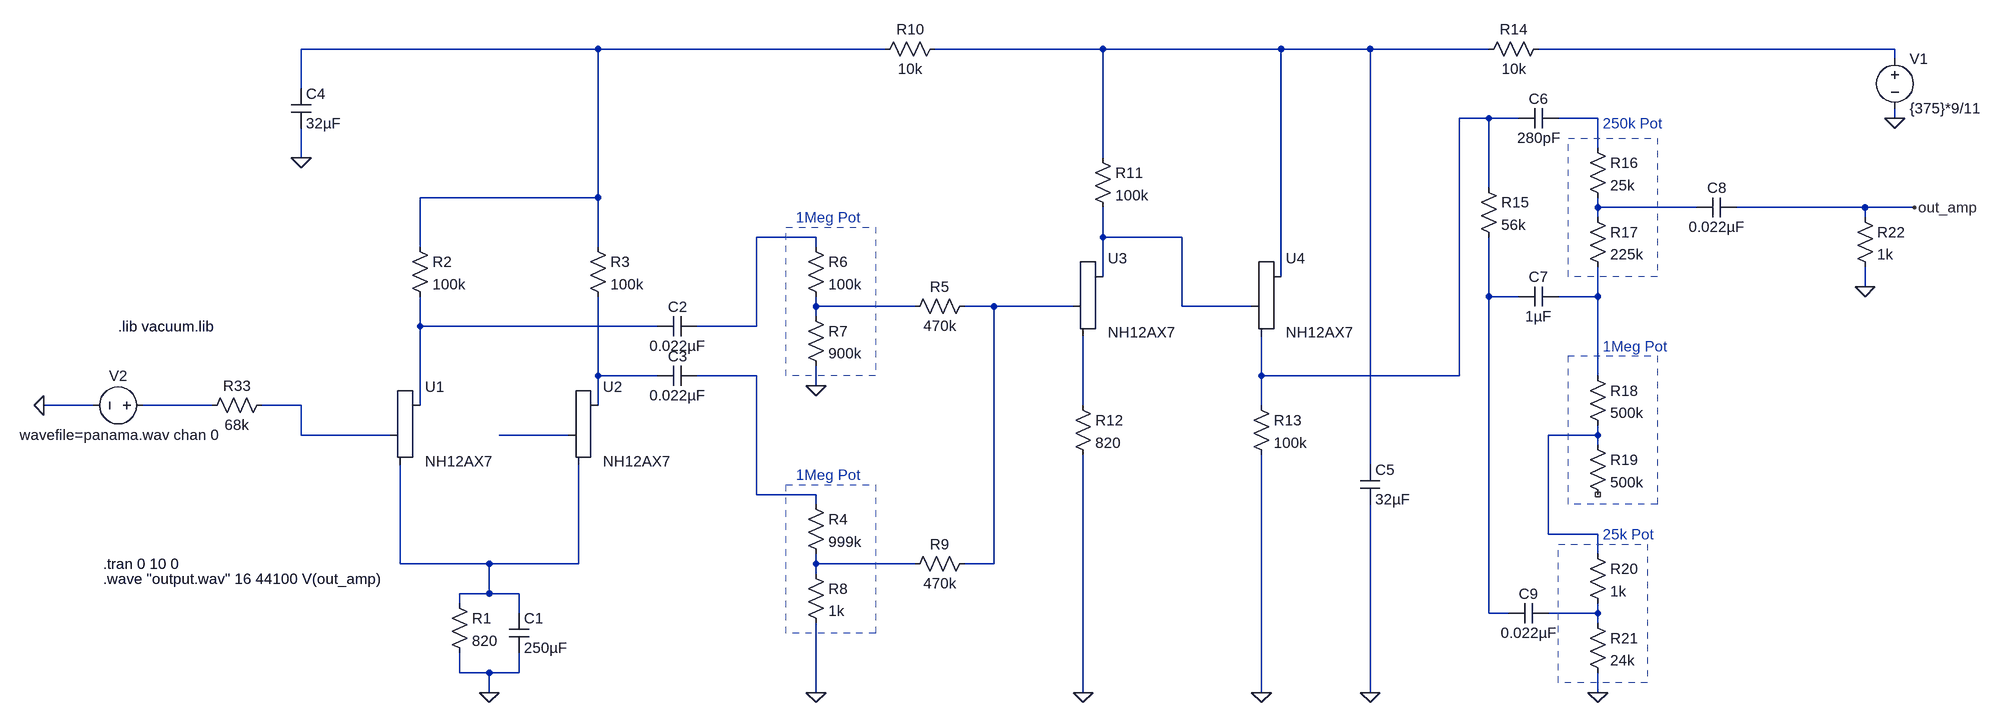
[diagram p0: schematic 1967 simle.asc]
1967 simle.asc, the LTspice schematic file:
Version 4
SHEET 1 3416 824
WIRE 656 -416 176 -416
WIRE 1120 -416 656 -416
WIRE 1472 -416 1200 -416
WIRE 1760 -416 1472 -416
WIRE 1904 -416 1760 -416
WIRE 2096 -416 1904 -416
WIRE 2752 -416 2176 -416
WIRE 2752 -400 2752 -416
WIRE 176 -352 176 -416
WIRE 2096 -304 2048 -304
WIRE 2144 -304 2096 -304
WIRE 2272 -304 2208 -304
WIRE 2752 -304 2752 -320
WIRE 2272 -256 2272 -304
WIRE 176 -240 176 -288
WIRE 1472 -240 1472 -416
WIRE 2096 -192 2096 -304
WIRE 656 -176 656 -416
WIRE 656 -176 368 -176
WIRE 2272 -160 2272 -176
WIRE 2432 -160 2272 -160
WIRE 2704 -160 2496 -160
WIRE 2784 -160 2704 -160
WIRE 2272 -144 2272 -160
WIRE 2704 -144 2704 -160
WIRE 1008 -112 912 -112
WIRE 1472 -112 1472 -160
WIRE 1600 -112 1472 -112
WIRE 368 -96 368 -176
WIRE 656 -96 656 -176
WIRE 1008 -96 1008 -112
WIRE 1472 -48 1472 -112
WIRE 1760 -48 1760 -416
WIRE 2704 -32 2704 -64
WIRE 2096 -16 2096 -112
WIRE 2144 -16 2096 -16
WIRE 2272 -16 2272 -64
WIRE 2272 -16 2208 -16
WIRE 1008 0 1008 -16
WIRE 1168 0 1008 0
WIRE 1296 0 1248 0
WIRE 1424 0 1296 0
WIRE 1600 0 1600 -112
WIRE 1712 0 1600 0
WIRE 1008 16 1008 0
WIRE 368 32 368 -16
WIRE 752 32 368 32
WIRE 912 32 912 -112
WIRE 912 32 816 32
WIRE 656 112 656 -16
WIRE 752 112 656 112
WIRE 912 112 816 112
WIRE 1728 112 1728 48
WIRE 2048 112 2048 -304
WIRE 2048 112 1728 112
WIRE 2272 112 2272 -16
WIRE 1008 128 1008 96
WIRE -160 160 -240 160
WIRE 32 160 -80 160
WIRE 176 160 112 160
WIRE 368 160 368 32
WIRE 656 160 656 112
WIRE 1440 160 1440 48
WIRE 1728 160 1728 112
WIRE 176 208 176 160
WIRE 320 208 176 208
WIRE 608 208 496 208
WIRE 2272 208 2272 192
WIRE 2272 208 2192 208
WIRE 2272 224 2272 208
WIRE 1904 256 1904 -416
WIRE 912 304 912 112
WIRE 1008 304 912 304
WIRE 1008 320 1008 304
WIRE 2192 368 2192 208
WIRE 2272 368 2192 368
WIRE 2272 400 2272 368
WIRE 336 416 336 256
WIRE 480 416 336 416
WIRE 624 416 624 256
WIRE 624 416 480 416
WIRE 1008 416 1008 400
WIRE 1168 416 1008 416
WIRE 1296 416 1296 0
WIRE 1296 416 1248 416
WIRE 1008 432 1008 416
WIRE 480 464 480 416
WIRE 480 464 432 464
WIRE 528 464 480 464
WIRE 432 480 432 464
WIRE 528 496 528 464
WIRE 2096 496 2096 -16
WIRE 2128 496 2096 496
WIRE 2272 496 2272 480
WIRE 2272 496 2192 496
WIRE 2272 512 2272 496
WIRE 432 592 432 560
WIRE 480 592 432 592
WIRE 528 592 528 560
WIRE 528 592 480 592
WIRE 480 624 480 592
WIRE 1008 624 1008 512
WIRE 1440 624 1440 240
WIRE 1728 624 1728 240
WIRE 1904 624 1904 320
WIRE 2272 624 2272 592
FLAG 480 624 0
FLAG 1008 128 0
FLAG 1008 624 0
FLAG 1440 624 0
FLAG 1728 624 0
FLAG 176 -240 0
FLAG 1904 624 0
FLAG 2272 624 0
FLAG -240 160 0
FLAG 2752 -304 0
FLAG 2704 -32 0
FLAG 2784 -160 out_amp
SYMBOL Misc\\triode 368 208 R0
SYMATTR InstName U1
SYMATTR Value NH12AX7
SYMATTR SpiceLine X1 A G K NH12AX7
SYMBOL res 416 464 R0
SYMATTR InstName R1
SYMATTR Value 820
SYMBOL cap 512 496 R0
SYMATTR InstName C1
SYMATTR Value 250µF
SYMBOL res 352 -112 R0
SYMATTR InstName R2
SYMATTR Value 100k
SYMBOL res 640 -112 R0
SYMATTR InstName R3
SYMATTR Value 100k
SYMBOL Misc\\triode 656 208 R0
SYMATTR InstName U2
SYMATTR Value NH12AX7
SYMATTR SpiceLine X1 A G K NH12AX7
SYMBOL cap 816 16 R90
WINDOW 0 0 32 VBottom 2
WINDOW 3 32 32 VTop 2
SYMATTR InstName C2
SYMATTR Value 0.022µF
SYMBOL cap 816 96 R90
WINDOW 0 0 32 VBottom 2
WINDOW 3 32 32 VTop 2
SYMATTR InstName C3
SYMATTR Value 0.022µF
SYMBOL res 1264 -16 R90
WINDOW 0 0 56 VBottom 2
WINDOW 3 32 56 VTop 2
SYMATTR InstName R5
SYMATTR Value 470k
SYMBOL res 992 -112 R0
SYMATTR InstName R6
SYMATTR Value 100k
SYMBOL res 992 0 R0
SYMATTR InstName R7
SYMATTR Value 900k
SYMBOL res 992 304 R0
SYMATTR InstName R4
SYMATTR Value 999k
SYMBOL res 992 416 R0
SYMATTR InstName R8
SYMATTR Value 1k
SYMBOL res 1264 400 R90
WINDOW 0 0 56 VBottom 2
WINDOW 3 32 56 VTop 2
SYMATTR InstName R9
SYMATTR Value 470k
SYMBOL res 1216 -432 R90
WINDOW 0 0 56 VBottom 2
WINDOW 3 32 56 VTop 2
SYMATTR InstName R10
SYMATTR Value 10k
SYMBOL res 1456 -256 R0
SYMATTR InstName R11
SYMATTR Value 100k
SYMBOL Misc\\triode 1472 0 R0
SYMATTR InstName U3
SYMATTR Value NH12AX7
SYMATTR SpiceLine X1 A G K NH12AX7
SYMBOL Misc\\triode 1760 0 R0
SYMATTR InstName U4
SYMATTR Value NH12AX7
SYMATTR SpiceLine X1 A G K NH12AX7
SYMBOL res 1424 144 R0
SYMATTR InstName R12
SYMATTR Value 820
SYMBOL res 1712 144 R0
SYMATTR InstName R13
SYMATTR Value 100k
SYMBOL res 2192 -432 R90
WINDOW 0 0 56 VBottom 2
WINDOW 3 32 56 VTop 2
SYMATTR InstName R14
SYMATTR Value 10k
SYMBOL cap 160 -352 R0
SYMATTR InstName C4
SYMATTR Value 32µF
SYMBOL cap 1888 256 R0
SYMATTR InstName C5
SYMATTR Value 32µF
SYMBOL cap 2208 -320 R90
WINDOW 0 0 32 VBottom 2
WINDOW 3 32 32 VTop 2
SYMATTR InstName C6
SYMATTR Value 280pF
SYMBOL res 2080 -208 R0
SYMATTR InstName R15
SYMATTR Value 56k
SYMBOL cap 2208 -32 R90
WINDOW 0 0 32 VBottom 2
WINDOW 3 32 32 VTop 2
SYMATTR InstName C7
SYMATTR Value 1µF
SYMBOL res 2256 -272 R0
SYMATTR InstName R16
SYMATTR Value 25k
SYMBOL res 2256 -160 R0
SYMATTR InstName R17
SYMATTR Value 225k
SYMBOL cap 2496 -176 R90
WINDOW 0 0 32 VBottom 2
WINDOW 3 32 32 VTop 2
SYMATTR InstName C8
SYMATTR Value 0.022µF
SYMBOL res 2256 96 R0
SYMATTR InstName R18
SYMATTR Value 500k
SYMBOL res 2256 208 R0
SYMATTR InstName R19
SYMATTR Value 500k
SYMBOL cap 2192 480 R90
WINDOW 0 0 32 VBottom 2
WINDOW 3 32 32 VTop 2
SYMATTR InstName C9
SYMATTR Value 0.022µF
SYMBOL res 2256 384 R0
SYMATTR InstName R20
SYMATTR Value 1k
SYMBOL res 2256 496 R0
SYMATTR InstName R21
SYMATTR Value 24k
SYMBOL res 128 144 R90
WINDOW 0 0 56 VBottom 2
WINDOW 3 32 56 VTop 2
SYMATTR InstName R33
SYMATTR Value 68k
SYMBOL voltage -64 160 R90
WINDOW 0 -32 56 VBottom 2
WINDOW 3 32 56 VTop 2
WINDOW 123 0 0 Left 0
WINDOW 39 0 0 Left 0
SYMATTR InstName V2
SYMATTR Value wavefile=panama.wav chan 0
SYMBOL voltage 2752 -416 R0
WINDOW 123 0 0 Left 0
WINDOW 39 0 0 Left 0
SYMATTR InstName V1
SYMATTR Value {375}*9/11
SYMBOL res 2688 -160 R0
SYMATTR InstName R22
SYMATTR Value 1k
TEXT -120 32 Left 2 !.lib vacuum.lib
TEXT -144 416 Left 2 !.tran 0 10 0
TEXT -144 440 Left 2 !.wave "output.wav" 16 44100 V(out_amp)
TEXT 976 -144 Left 2 ;1Meg Pot
TEXT 976 272 Left 2 ;1Meg Pot
TEXT 2280 -296 Left 2 ;250k Pot
TEXT 2280 64 Left 2 ;1Meg Pot
TEXT 2280 368 Left 2 ;25k Pot
RECTANGLE Normal 1104 112 960 -128 2
RECTANGLE Normal 1104 528 960 288 2
RECTANGLE Normal 2368 -48 2224 -272 2
RECTANGLE Normal 2368 320 2224 80 2
RECTANGLE Normal 2352 608 2208 384 2

The netlist it stands for:
* 1967 simle.asc
XU1 N013 N017 N021 NH12AX7 X1 A G K NH12AX7
R1 N021 0 820
C1 N021 0 250µF
R2 N001 N013 100k
R3 N001 N014 100k
XU2 N014 N019 N021 NH12AX7 X1 A G K NH12AX7
C2 N007 N013 0.022µF
C3 N015 N014 0.022µF
R5 N012 N011 470k
R6 N007 N011 100k
R7 N011 0 900k
R4 N015 N022 999k
R8 N022 0 1k
R9 N012 N022 470k
R10 N002 N001 10k
R11 N002 N008 100k
XU3 N008 N012 N018 NH12AX7 X1 A G K NH12AX7
XU4 N002 N008 N004 NH12AX7 X1 A G K NH12AX7
R12 N018 0 820
R13 N004 0 100k
R14 N003 N002 10k
C4 N001 0 32µF
C5 N002 0 32µF
C6 N005 N004 280pF
R15 N004 N009 56k
C7 N010 N009 1µF
R16 N005 N006 25k
R17 N006 N010 225k
C8 out_amp N006 0.022µF
R18 N010 N020 500k
R19 N020 NC_01 500k
C9 N023 N009 0.022µF
R20 N020 N023 1k
R21 N023 0 24k
R33 N017 N016 68k
V2 N016 0 wavefile=panama.wav chan 0
V1 N003 0 {375}*9/11
R22 out_amp 0 1k
.lib vacuum.lib
.tran 0 10 0
.wave "output.wav" 16 44100 V(out_amp)
* 1Meg Pot
* 1Meg Pot
* 250k Pot
* 1Meg Pot
* 25k Pot
.backanno
.end